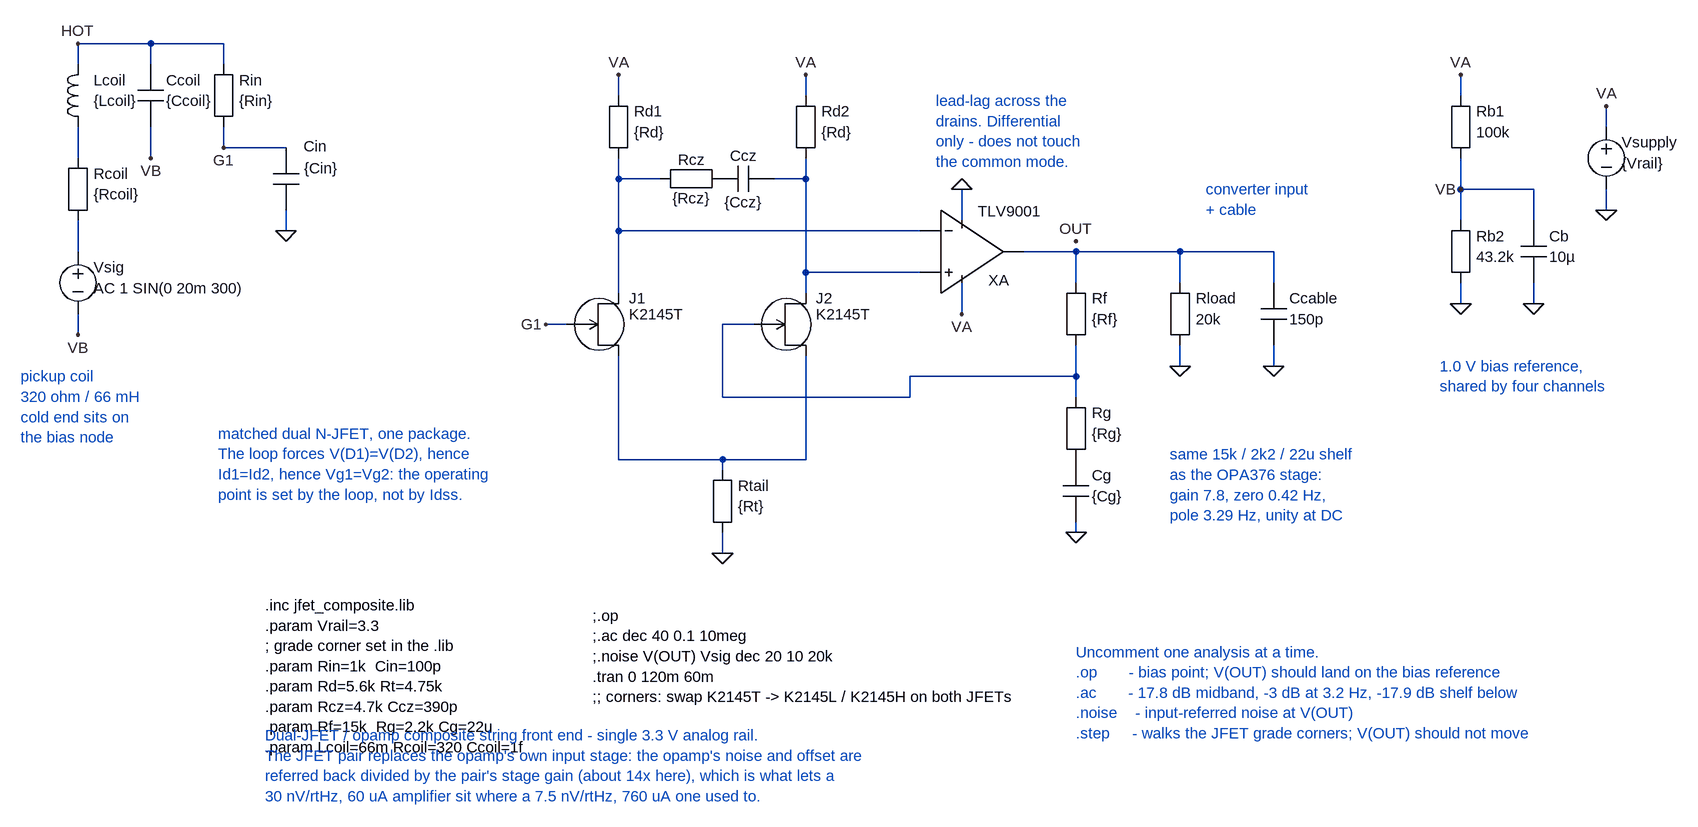
[diagram p0: schematic composite_dual.asc]
composite_dual.asc, the LTspice schematic file:
Version 4
SHEET 1 2300 1180
WIRE -64 16 -176 16
WIRE 48 16 -64 16
WIRE -176 48 -176 16
WIRE -64 48 -64 16
WIRE 48 48 48 16
WIRE 656 96 656 64
WIRE 944 96 944 64
WIRE 1952 96 1952 64
WIRE 2176 144 2176 112
WIRE 48 176 48 144
WIRE 144 176 48 176
WIRE -176 192 -176 144
WIRE -64 192 -64 144
WIRE 656 224 656 192
WIRE 720 224 656 224
WIRE 816 224 800 224
WIRE 944 224 944 192
WIRE 944 224 896 224
WIRE 1952 240 1952 192
WIRE 2064 240 1952 240
WIRE 2176 272 2176 240
WIRE 1184 288 1184 240
WIRE 1952 288 1952 240
WIRE 2064 288 2064 240
WIRE 144 304 144 272
WIRE 656 304 656 224
WIRE 1120 304 656 304
WIRE -176 336 -176 288
WIRE 1360 336 1280 336
WIRE 1520 336 1360 336
WIRE 1664 336 1520 336
WIRE 944 368 944 224
WIRE 1120 368 944 368
WIRE 1360 384 1360 336
WIRE 1520 384 1520 336
WIRE 1664 384 1664 336
WIRE 656 400 656 304
WIRE 944 400 944 368
WIRE 1952 416 1952 384
WIRE 2064 416 2064 384
WIRE 1184 432 1184 384
WIRE 576 448 544 448
WIRE 864 448 816 448
WIRE -176 464 -176 432
WIRE 1520 512 1520 480
WIRE 1664 512 1664 480
WIRE 1360 528 1360 480
WIRE 1360 528 1104 528
WIRE 816 560 816 448
WIRE 1104 560 1104 528
WIRE 1104 560 816 560
WIRE 1360 560 1360 528
WIRE 656 656 656 496
WIRE 816 656 656 656
WIRE 944 656 944 496
WIRE 944 656 816 656
WIRE 816 672 816 656
WIRE 1360 768 1360 752
WIRE 816 800 816 768
FLAG -176 16 HOT
FLAG -176 464 VB
FLAG -64 192 VB
FLAG 48 176 G1
FLAG 144 304 0
FLAG 544 448 G1
FLAG 656 64 VA
FLAG 944 64 VA
FLAG 816 800 0
FLAG 1184 432 VA
FLAG 1184 240 0
FLAG 1360 320 OUT
FLAG 1360 768 0
FLAG 1520 512 0
FLAG 1664 512 0
FLAG 1952 64 VA
FLAG 1952 240 VB
FLAG 1952 416 0
FLAG 2064 416 0
FLAG 2176 112 VA
FLAG 2176 272 0
SYMBOL zind -176 96 R0
SYMATTR InstName Lcoil
SYMATTR Value {Lcoil}
SYMBOL zres -176 240 R0
SYMATTR InstName Rcoil
SYMATTR Value {Rcoil}
SYMBOL zvsrc -176 384 R0
SYMATTR InstName Vsig
SYMATTR Value AC 1 SIN(0 20m 300)
SYMBOL zcap -64 96 R0
SYMATTR InstName Ccoil
SYMATTR Value {Ccoil}
SYMBOL zres 48 96 R0
SYMATTR InstName Rin
SYMATTR Value {Rin}
SYMBOL zcap 144 224 R0
WINDOW 0 27 -50 Left 2
WINDOW 3 28 -16 Left 2
SYMATTR InstName Cin
SYMATTR Value {Cin}
SYMBOL zjfet 624 448 R0
SYMATTR InstName J1
SYMBOL zjfet 912 448 R0
SYMATTR InstName J2
SYMBOL zres 656 144 R0
SYMATTR InstName Rd1
SYMATTR Value {Rd}
SYMBOL zres 944 144 R0
SYMATTR InstName Rd2
SYMATTR Value {Rd}
SYMBOL zres 816 720 R0
SYMATTR InstName Rtail
SYMATTR Value {Rt}
SYMBOL zres 768 224 R270
WINDOW 0 14 0 VTop 2
WINDOW 3 -14 0 VBottom 2
SYMATTR InstName Rcz
SYMATTR Value {Rcz}
SYMBOL zcap 848 224 R270
WINDOW 0 20 0 VTop 2
WINDOW 3 -20 0 VBottom 2
SYMATTR InstName Ccz
SYMATTR Value {Ccz}
SYMBOL zopamp 1200 336 M180
WINDOW 0 25 -44 Left 2
WINDOW 3 9 62 Left 2
SYMATTR InstName XA
SYMBOL zres 1360 432 R0
SYMATTR InstName Rf
SYMATTR Value {Rf}
SYMBOL zres 1360 608 R0
SYMATTR InstName Rg
SYMATTR Value {Rg}
SYMBOL zcap 1360 704 R0
SYMATTR InstName Cg
SYMATTR Value {Cg}
SYMBOL zres 1520 432 R0
SYMATTR InstName Rload
SYMATTR Value 20k
SYMBOL zcap 1664 432 R0
SYMATTR InstName Ccable
SYMATTR Value 150p
SYMBOL zres 1952 144 R0
SYMATTR InstName Rb1
SYMATTR Value 100k
SYMBOL zres 1952 336 R0
SYMATTR InstName Rb2
SYMATTR Value 43.2k
SYMBOL zcap 2064 336 R0
SYMATTR InstName Cb
SYMATTR Value 10µ
SYMBOL zvsrc 2176 192 R0
SYMATTR InstName Vsupply
SYMATTR Value {Vrail}
TEXT -264 528 Left 2 ;pickup coil\n320 ohm / 66 mH\ncold end sits on\nthe bias node
TEXT 40 616 Left 2 ;matched dual N-JFET, one package.\nThe loop forces V(D1)=V(D2), hence\nId1=Id2, hence Vg1=Vg2: the operating\npoint is set by the loop, not by Idss.
TEXT 1144 104 Left 2 ;lead-lag across the\ndrains. Differential\nonly - does not touch\nthe common mode.
TEXT 1504 648 Left 2 ;same 15k / 2k2 / 22u shelf\nas the OPA376 stage:\ngain 7.8, zero 0.42 Hz,\npole 3.29 Hz, unity at DC
TEXT 1560 240 Left 2 ;converter input\n+ cable
TEXT 1920 512 Left 2 ;1.0 V bias reference,\nshared by four channels
TEXT 112 880 Left 2 !.inc jfet_composite.lib\n.param Vrail=3.3\n; grade corner set in the .lib\n.param Rin=1k  Cin=100p\n.param Rd=5.6k Rt=4.75k\n.param Rcz=4.7k Ccz=390p\n.param Rf=15k  Rg=2.2k Cg=22u\n.param Lcoil=66m Rcoil=320 Ccoil=1f
TEXT 616 896 Left 2 !;.op\n;.ac dec 40 0.1 10meg\n;.noise V(OUT) Vsig dec 20 10 20k\n.tran 0 120m 60m\n;; corners: swap K2145T -> K2145L / K2145H on both JFETs
TEXT 1360 952 Left 2 ;Uncomment one analysis at a time.\n.op       - bias point; V(OUT) should land on the bias reference\n.ac       - 17.8 dB midband, -3 dB at 3.2 Hz, -17.9 dB shelf below\n.noise    - input-referred noise at V(OUT)\n.step     - walks the JFET grade corners; V(OUT) should not move
TEXT 112 1080 Left 2 ;Dual-JFET / opamp composite string front end - single 3.3 V analog rail.\nThe JFET pair replaces the opamp's own input stage: the opamp's noise and offset are\nreferred back divided by the pair's stage gain (about 14x here), which is what lets a\n30 nV/rtHz, 60 uA amplifier sit where a 7.5 nV/rtHz, 760 uA one used to.

The netlist it stands for:
* composite_dual.asc
Lcoil HOT N001 {Lcoil}
Rcoil N001 N005 {Rcoil}
Vsig N005 VB AC 1 SIN(0 20m 300)
Ccoil HOT VB {Ccoil}
Rin HOT G1 {Rin}
Cin G1 0 {Cin}
J1 N002 G1 N008 K2145T
J2 N004 N007 N008 K2145T
Rd1 VA N002 {Rd}
Rd2 VA N004 {Rd}
Rtail N008 0 {Rt}
Rcz N002 N003 {Rcz}
Ccz N003 N004 {Ccz}
XXA N004 N002 VA 0 N006 TLV9001  ; pins In+ In- V+ V- OUT
Rf N006 N007 {Rf}
Rg N007 P001 {Rg}
Cg P001 0 {Cg}
Rload N006 0 20k
Ccable N006 0 150p
Rb1 VA VB 100k
Rb2 VB 0 43.2k
Cb VB 0 10µ
Vsupply VA 0 {Vrail}
.model NJF NJF
.model PJF PJF
.lib standard.jft
* pickup coil
* 320 ohm / 66 mH
* cold end sits on
* the bias node
* matched dual N-JFET, one package.
* The loop forces V(D1)=V(D2), hence
* Id1=Id2, hence Vg1=Vg2: the operating
* point is set by the loop, not by Idss.
* lead-lag across the
* drains. Differential
* only - does not touch
* the common mode.
* same 15k / 2k2 / 22u shelf
* as the OPA376 stage:
* gain 7.8, zero 0.42 Hz,
* pole 3.29 Hz, unity at DC
* converter input
* + cable
* 1.0 V bias reference,
* shared by four channels
.inc jfet_composite.lib
.param Vrail=3.3
; grade corner set in the .lib
.param Rin=1k  Cin=100p
.param Rd=5.6k Rt=4.75k
.param Rcz=4.7k Ccz=390p
.param Rf=15k  Rg=2.2k Cg=22u
.param Lcoil=66m Rcoil=320 Ccoil=1f
;.op
;.ac dec 40 0.1 10meg
;.noise V(OUT) Vsig dec 20 10 20k
.tran 0 120m 60m
;; corners: swap K2145T -> K2145L / K2145H on both JFETs
* Uncomment one analysis at a time.
* .op       - bias point; V(OUT) should land on the bias reference
* .ac       - 17.8 dB midband, -3 dB at 3.2 Hz, -17.9 dB shelf below
* .noise    - input-referred noise at V(OUT)
* .step     - walks the JFET grade corners; V(OUT) should not move
* Dual-JFET / opamp composite string front end - single 3.3 V analog rail.
* The JFET pair replaces the opamp's own input stage: the opamp's noise and offset are
* referred back divided by the pair's stage gain (about 14x here), which is what lets a
* 30 nV/rtHz, 60 uA amplifier sit where a 7.5 nV/rtHz, 760 uA one used to.
.backanno
.end